# Altium schematic sheet Interface.SchDoc
size A4; SheetNumber: 3; SheetTotal: 4
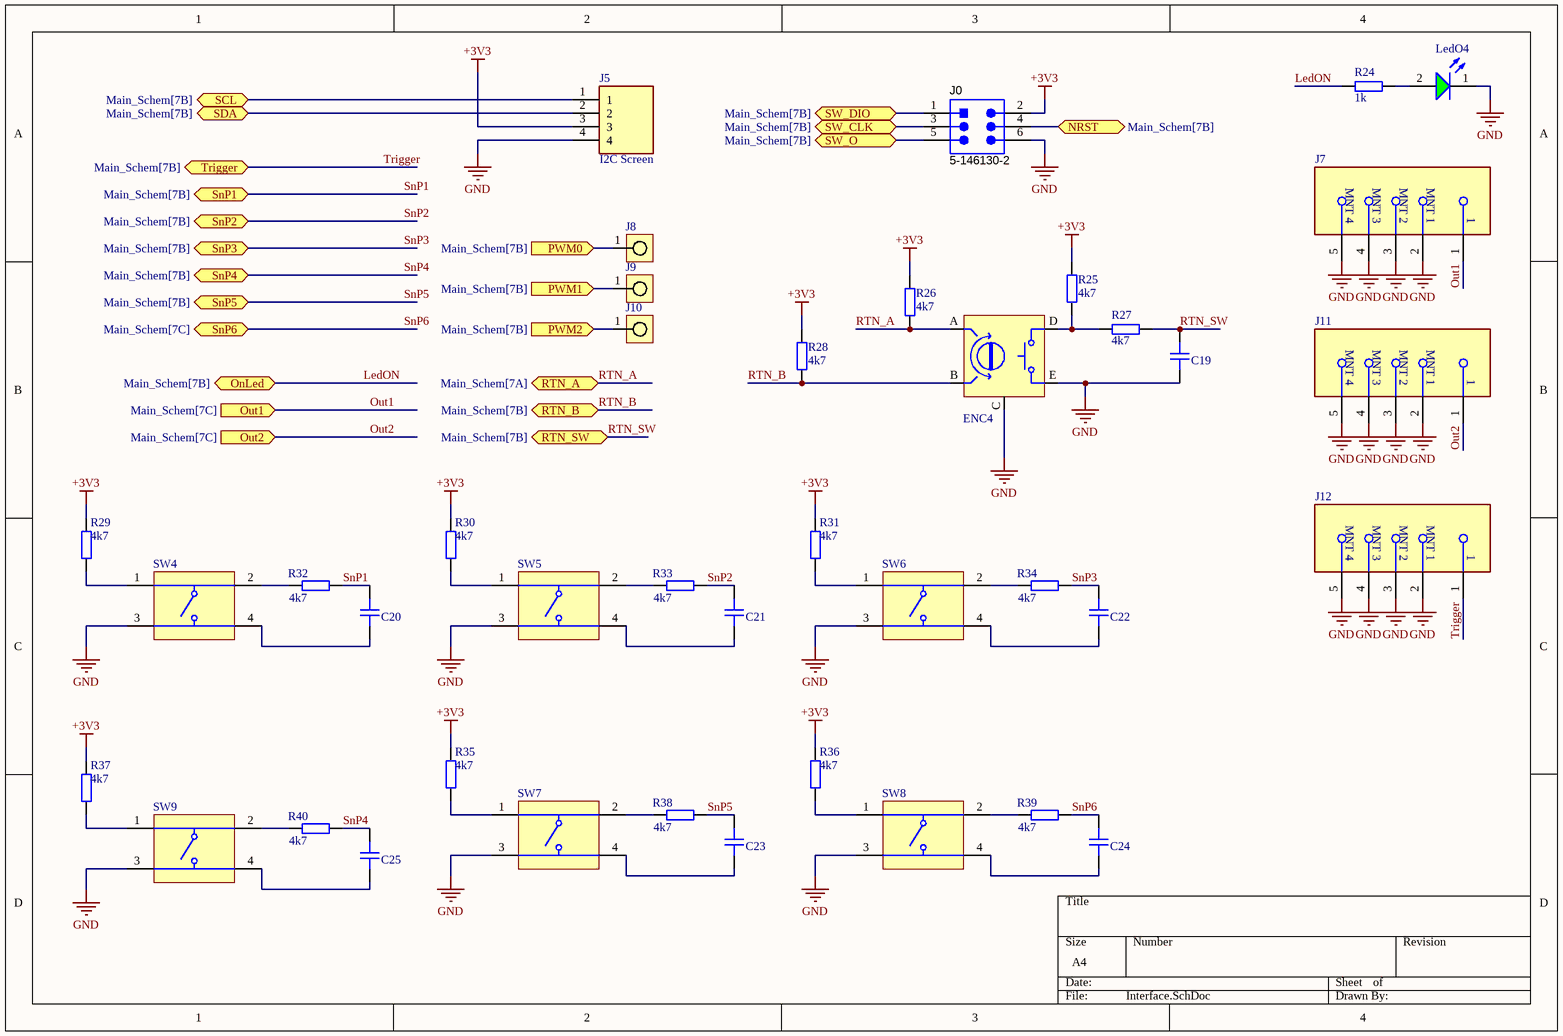
[diagram p0: Interface.SchDoc]

## Parts
C19  CAP_0805  [CAP_0805]  (value not drawn)
C20  CAP_0805  [CAP_0805]  (value not drawn)
C21  CAP_0805  [CAP_0805]  (value not drawn)
C22  CAP_0805  [CAP_0805]  (value not drawn)
C23  CAP_0805  [CAP_0805]  (value not drawn)
C24  CAP_0805  [CAP_0805]  (value not drawn)
C25  CAP_0805  [CAP_0805]  (value not drawn)
ENC4  EN11-HSM1BF20  [EN11-HSM]  (value not drawn)
J0  5-146130-2  [TECO-5-146130-2_V]
J5  I2C Screen  [RHDR4W70P0X254_1X4_1056X250X850P]
J7  1-1337445-0  [FP-1-1337445-0-MFG]  (value not drawn)
J8  SOLDER_PIN_THT  [SOLDER_PIN_THT_1_5]  (value not drawn)
J9  SOLDER_PIN_THT  [SOLDER_PIN_THT_1_5]  (value not drawn)
J10  SOLDER_PIN_THT  [SOLDER_PIN_THT_1_5]  (value not drawn)
J11  1-1337445-0  [FP-1-1337445-0-MFG]  (value not drawn)
J12  1-1337445-0  [FP-1-1337445-0-MFG]  (value not drawn)
LedO4  151053GS03000  [WL-TMRW_D5.8H11.7]  (value not drawn)
R24  1k  [RES_0805]
R25  4k7  [RES_0805]
R26  4k7  [RES_0805]
R27  4k7  [RES_0805]
R28  4k7  [RES_0805]
R29  4k7  [RES_0805]
R30  4k7  [RES_0805]
R31  4k7  [RES_0805]
R32  4k7  [RES_0805]
R33  4k7  [RES_0805]
R34  4k7  [RES_0805]
R35  4k7  [RES_0805]
R36  4k7  [RES_0805]
R37  4k7  [RES_0805]
R38  4k7  [RES_0805]
R39  4k7  [RES_0805]
R40  4k7  [RES_0805]
SW4  1825910-6  [TECO-1825910-6_V]  (value not drawn)
SW5  1825910-6  [TECO-1825910-6_V]  (value not drawn)
SW6  1825910-6  [TECO-1825910-6_V]  (value not drawn)
SW7  1825910-6  [TECO-1825910-6_V]  (value not drawn)
SW8  1825910-6  [TECO-1825910-6_V]  (value not drawn)
SW9  1825910-6  [TECO-1825910-6_V]  (value not drawn)

## Ports
NRST (bidir, see Main_Schem[7B]), OnLed (bidir, see Main_Schem[7B]), Out1 (in, see Main_Schem[7C]), Out2 (in, see Main_Schem[7C]), PWM0 (in, see Main_Schem[7B]), PWM1 (in, see Main_Schem[7B]), PWM2 (in, see Main_Schem[7B]), RTN_A (bidir, see Main_Schem[7A]), RTN_B (bidir, see Main_Schem[7B]), RTN_SW (bidir, see Main_Schem[7B]), SCL (bidir, see Main_Schem[7B]), SDA (bidir, see Main_Schem[7B]), SnP1 (bidir, see Main_Schem[7B]), SnP2 (bidir, see Main_Schem[7B]), SnP3 (bidir, see Main_Schem[7B]), SnP4 (bidir, see Main_Schem[7B]), SnP5 (bidir, see Main_Schem[7B]), SnP6 (bidir, see Main_Schem[7C]), SW_CLK (bidir, see Main_Schem[7B]), SW_DIO (bidir, see Main_Schem[7B]), SW_O (bidir, see Main_Schem[7B]), Trigger (bidir, see Main_Schem[7B])

## Nets
+3V3: J0.2 J5.3 R25.2 R26.2 R28.2 R29.2 R30.2 R31.2 R35.2 R36.2 R37.2
GND: C19.1 ENC4.C(GND) ENC4.E J0.6 J5.4 J7.2(MNT_1) J7.3(MNT_2) J7.4(MNT_3) J7.5(MNT_4) J11.2(MNT_1) J11.3(MNT_2) J11.4(MNT_3) J11.5(MNT_4) J12.2(MNT_1) J12.3(MNT_2) J12.4(MNT_3) J12.5(MNT_4) LedO4.1(K) SW4.3 SW5.3 SW6.3 SW7.3 SW8.3 SW9.3
LedON: R24.2 ; port OnLed
NRST: J0.4 ; port NRST
Out1: J7.1 ; port Out1
Out2: J11.1 ; port Out2
PWM0: J8.1 ; port PWM0
PWM1: J9.1 ; port PWM1
PWM2: J10.1 ; port PWM2
RTN_A: ENC4.A R26.1 ; port RTN_A
RTN_B: ENC4.B R28.1 ; port RTN_B
RTN_SW: C19.2 R27.1 ; port RTN_SW
SCL: J5.1 ; port SCL
SDA: J5.2 ; port SDA
SnP1: C20.2 R32.1 ; port SnP1
SnP2: C21.2 R33.1 ; port SnP2
SnP3: C22.2 R34.1 ; port SnP3
SnP4: C25.2 R40.1 ; port SnP4
SnP5: C23.2 R38.1 ; port SnP5
SnP6: C24.2 R39.1 ; port SnP6
SW_CLK: J0.3 ; port SW_CLK
SW_DIO: J0.1 ; port SW_DIO
SW_O: J0.5 ; port SW_O
Trigger: J12.1 ; port Trigger
NetC20_1: C20.1 SW4.4
NetC21_1: C21.1 SW5.4
NetC22_1: C22.1 SW6.4
NetC23_1: C23.1 SW7.4
NetC24_1: C24.1 SW8.4
NetC25_1: C25.1 SW9.4
NetENC4_D: ENC4.D R25.1 R27.2
NetLedO4_2: LedO4.2(A) R24.1
NetR29_1: R29.1 SW4.1
NetR30_1: R30.1 SW5.1
NetR31_1: R31.1 SW6.1
NetR32_2: R32.2 SW4.2
NetR33_2: R33.2 SW5.2
NetR34_2: R34.2 SW6.2
NetR35_1: R35.1 SW7.1
NetR36_1: R36.1 SW8.1
NetR37_1: R37.1 SW9.1
NetR38_2: R38.2 SW7.2
NetR39_2: R39.2 SW8.2
NetR40_2: R40.2 SW9.2

## Library data of the parts
C19-C25 = CMP-001-00086-1: Capacitor SMD 0805; Dielectric: *; Component Type: Standard; LCSC: *; Source: Kostas_Psarras_Schem_Lib.SchLib; Rating: *; Pins: 2; Distributor Link: *; Manufacturer: *; Manufacturer Part Number: *; Design Item ID: CAP_0805
ENC4 = EN11-HSM1BF20: Rotary Encoder with Switch 20 Detents 7mm Bushing 20mm Threaded Shaft Vertical; Manufacturer: TT Electronics; Manufacturer Part Number: EN11-HSM1BF20; Distributor Link: https://www.mouser.de/ProductDetail/BI-Technologies-TT-Electronics/EN11-HSM1BF20?qs=%252BUYXD5bnyXp4Uf1MU7v3zw%3D%3D
J0 = CMP-002-00018-2: Male Header, Pitch 2.54 mm, 2 x 3 Position, Height 8.13 mm, -65 to 125 degC, RoHS, Tube; Manufacturer: TE Connectivity; Max Operating Temperature: 125°C; Datasheet Version: Oct-15; Package Description: Male Header, Pitch 2.54 mm, 2 x 3 Position, Height 8.13 mm; Case/Package: 5-146130-2; Datasheet URL: http://www.te.com/commerce/DocumentDelivery/DDEController?Action=showdoc&DocId=Customer+Drawing%7F146130%7FM%7Fpdf%7FEnglish%7FENG_CD_146130_M.pdf%7F5-146130-2; Manufacturer URL: http://www.te.com/; Connector Type: Header; Gender: Male; Mounting Technology: SM; Min Operating Temperature: -65°C; RoHS Compliant: Unknown; Package Reference: 5-146130-2
J5 = CMP-002-00191-1: M20: 4 Pos Receptacle SIL Straight 3mm THT Connector 8.5mm high Tin; Manufacturer_Name: Harwin; Source: Kostas_Psarras_Schem_Lib.SchLib; Height: 8.5mm; Manufacturer_Part_Number: M20-7820446; Mouser Price/Stock: https://www.mouser.co.uk/ProductDetail/Harwin/M20-7820446?qs=vF78I%252BjhbY8%252Bno0H8mp9XA%3D%3D; Design Item ID: M20-7820446; Datasheet Link: https://content.harwin.com/m/c2ac50ebb1c800d5/original/DRG-00385-Technical-Drawing-Datasheet-M20-782-pdf.pdf; Mouser Part Number: 855-M20-7820446
J7 J11 J12 = CMP-03357-000006-1: CONN BNC JACK STR 50 OHM PCB; PCB Mount Retention: With; Operating Frequency: 0 to 4Hz; PCB Mounting Orientation: Vertical; PCB Thickness: 0.126inch; Body Plating: Silver; Frequency: 4GHz; Impedance: 50R; Insulation Resistance: 5GR; Body Material: Brass; Dielectric Material: PTFE; Gender: Female; Sealable: No (Without); Number of Positions: 1; Orientation: Straight; RoHS Compliant: Yes; Min Operating Temperature: -65°C; Packaging: Bag; Fastening Type: Bayonet; Radiation Hardening: No; Max Frequency: 4GHz; Material: Brass; Contact Plating: Silver; ELV: Compliant; Depth: 12mm; Series: BNC; Package Quantity: 50; Connector Type: BNC; Contact Material: Brass; Max Operating Temperature: 165°C; Length: 12mm; Termination: Solder; Mount: Through Hole; Insulation Material: Polytetrafluoroethylene
J8-J10 = CMP-018-000020-1: Solder Pin 1.5mm Through-Hole; Source: Kostas_Psarras_Schem_Lib.SchLib; Design Item ID: SOLDER_PIN_THT
LedO4 = CMP-1489-00005-2: NexarPartId: 29717817; Viewing Angle: 30°; Wavelength: 522nm; Max Reverse Voltage (DC): 5V; Test Current: 20mA; Forward Current: 100mA; Forward Voltage: 3.4V; Lens Style: Circular, Clear, Round; Luminous Intensity: 10cd; Lens Size: 5mm; Peak Wavelength: 515nm; Length: 5mm; Min Operating Temperature: -40°C; Color: Green; Case/Package: Radial; REACH SVHC: Unknown; Height: 8.6mm; Mount: Through Hole; Dominant Wavelength: 522nm; Max Operating Temperature: 85°C; Width: 5mm; Packaging: Bulk; RoHS: Compliant
R24 = RES_0805: Resistor SMD 0805; Manufacturer: *; Manufacturer Part Number: *; Distributor Link: *; LCSC: *
R25-R40 = CMP-009-00182-1: Resistor SMD 0805; Design Item ID: RES_0805; Pins: 2; Manufacturer: *; Manufacturer Part Number: *; Source: Kostas_Psarras_Schem_Lib.SchLib; Component Type: Standard; LCSC: *; Distributor Link: *
SW4-SW9 = CMP-1684-00021-1: Tact Switch, SPST-NO, 0.05 A, -35 to 85 degC, 4-Pin THD, RoHS, Bulk; Manufacturer: TE Connectivity; Maximum Contact Resistance: 100mOhm; Mechanical Life: 100000Cycles; Bushing Type: Unthreaded; Switch Configuration: OFF(ON); Maximum DC Voltage Rating: 24V; Contact Rating @ Voltage: 0.05A@24VDC; Actuator Color: Black; Body Orientation: Straight; Function: MomentaryContact; Illumination: N/R; Actuator Style: RoundButton; Actuator Material: PolybutyleneTerephthalate; Dielectric Strength: 500VAC; Pole Throw Configuration: SPST; Actuator Length: 1.4mm; Product Weight: N/A; Contact Material: CopperAlloy; Housing Material: N/A; Terminal Type: PCPins; Minimum Insulation Resistance: 100MOhm; Package Description: 4-Pin Through Hole Device, Body 5.99 x 5.99 mm, Pitch 6.5 mm; Part No: 1825910-6; Package Reference: THD; Base Material: N/A; Manufacturer URL: http://www.te.com; Contact Plating: Silver; RoHS: Yes; Datasheet Version: Rev. C9; Electrical Life: 100000Cycles; Maximum AC Voltage Rating: N/A; Thread Size: N/R; Operating Temperature: -35to85C; Mounting: ThroughHole; Dimension: 5.99x5mm; Datasheet URL: http://www.te.com/commerce/DocumentDelivery/DDEController?Action=showdoc&DocId=Customer+Drawing%7F1825910%7FC9%7Fpdf%7FEnglish%7FENG_CD_1825910_C9.pdf%7F1825910-6; Family: 1825910; Seal Location: N/A; Seal Description: N/A; Packaging: N/A